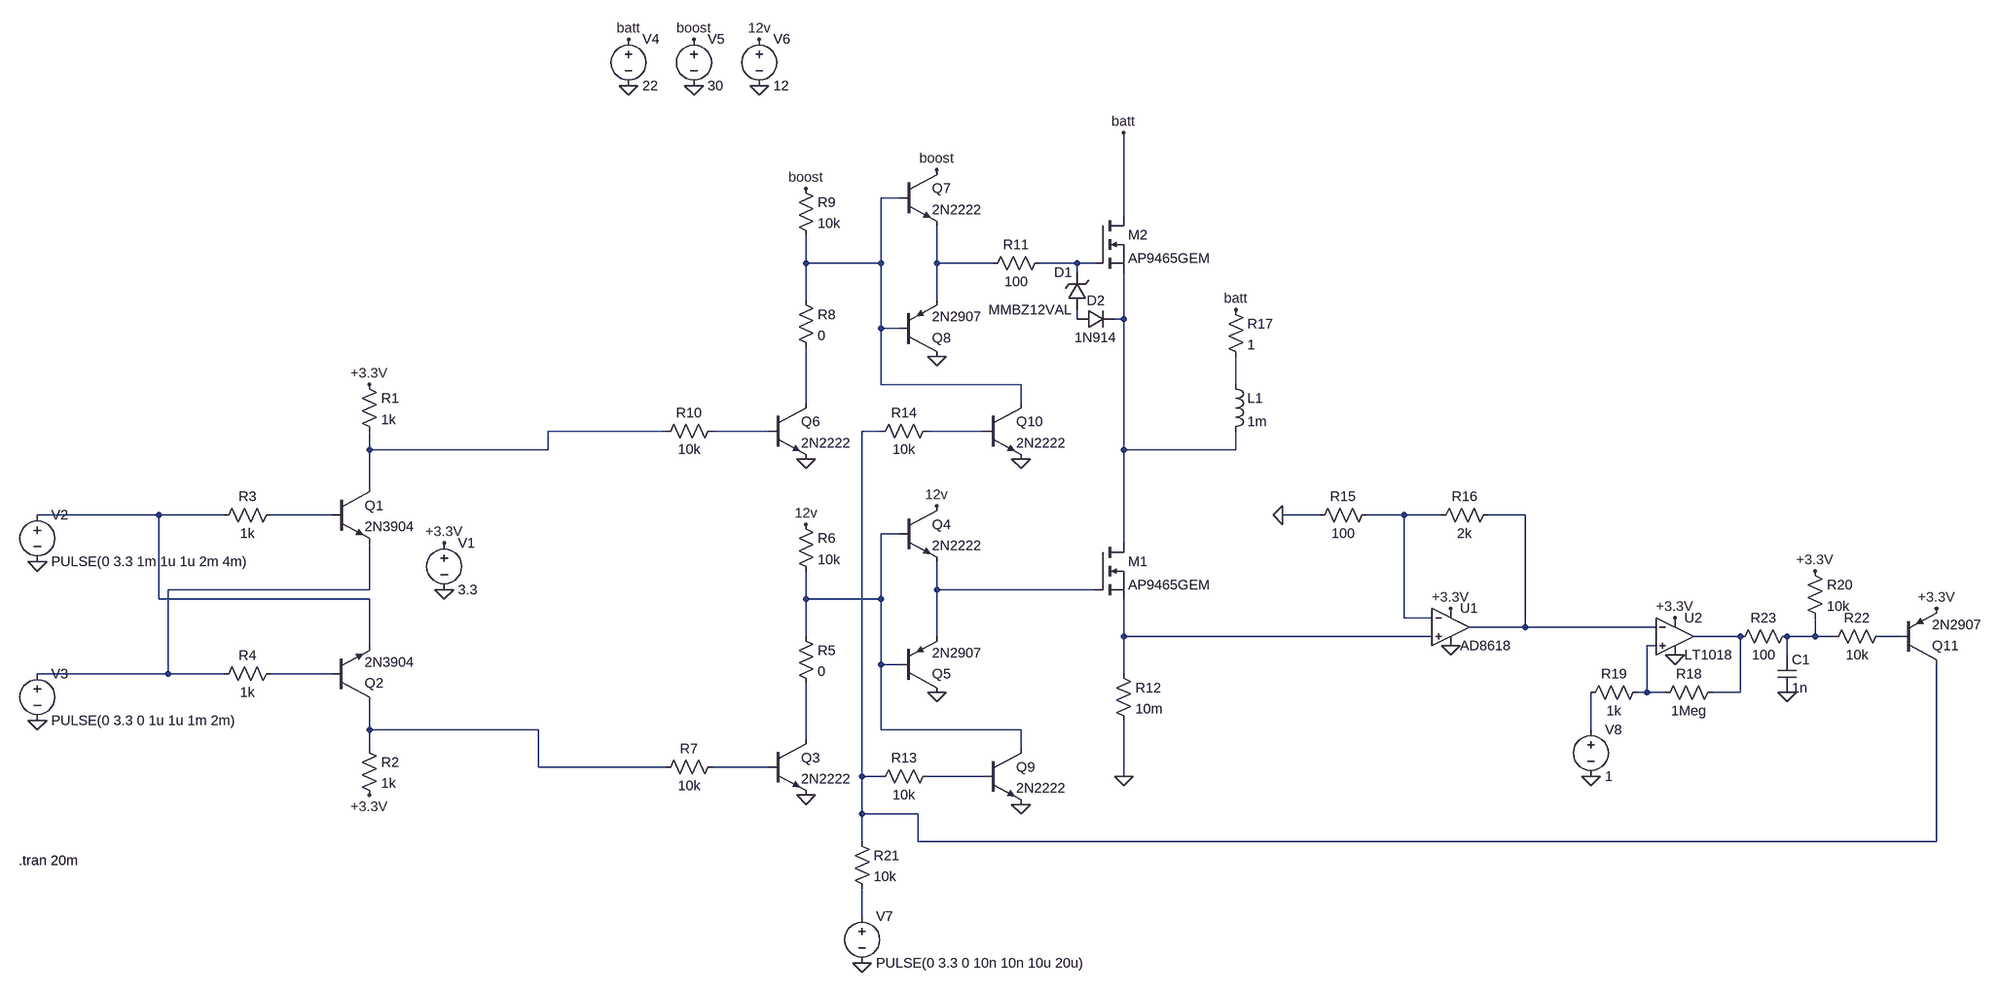
[diagram p0: schematic Half_Bridge_with_Shoot-thru_prot_and_PWM_ILIM.asc]
Half_Bridge_with_Shoot-thru_prot_and_PWM_ILIM.asc, the LTspice schematic file:
Version 4
SHEET 1 3380 868
WIRE 1296 -464 1264 -464
WIRE 1680 -432 1680 -576
WIRE 1136 -352 1136 -400
WIRE 1264 -352 1264 -464
WIRE 1264 -352 1136 -352
WIRE 1360 -352 1360 -416
WIRE 1456 -352 1360 -352
WIRE 1600 -352 1536 -352
WIRE 1632 -352 1600 -352
WIRE 1600 -336 1600 -352
WIRE 1136 -288 1136 -352
WIRE 1360 -288 1360 -352
WIRE 1600 -256 1600 -272
WIRE 1680 -256 1680 -336
WIRE 1680 -256 1664 -256
WIRE 1264 -240 1264 -352
WIRE 1296 -240 1264 -240
WIRE 1264 -144 1264 -240
WIRE 1504 -144 1264 -144
WIRE 1872 -144 1872 -192
WIRE 1136 -112 1136 -208
WIRE 1504 -112 1504 -144
WIRE 896 -64 624 -64
WIRE 1072 -64 976 -64
WIRE 1264 -64 1232 -64
WIRE 1440 -64 1344 -64
WIRE 160 -32 160 -64
WIRE 624 -32 624 -64
WIRE 624 -32 160 -32
WIRE 1680 -32 1680 -256
WIRE 1872 -32 1872 -64
WIRE 1872 -32 1680 -32
WIRE 160 32 160 -32
WIRE -224 80 -432 80
WIRE -112 80 -224 80
WIRE 96 80 -32 80
WIRE 2016 80 1952 80
WIRE 2160 80 2096 80
WIRE 2224 80 2160 80
WIRE 2368 80 2304 80
WIRE 1296 112 1264 112
WIRE 1680 128 1680 -32
WIRE 160 208 160 128
WIRE 160 208 -208 208
WIRE 1360 208 1360 160
WIRE 1632 208 1360 208
WIRE -224 224 -224 80
WIRE 160 224 -224 224
WIRE 1136 224 1136 176
WIRE 1264 224 1264 112
WIRE 1264 224 1136 224
WIRE 2160 256 2160 80
WIRE 2208 256 2160 256
WIRE 2368 272 2368 80
WIRE 2368 272 2272 272
WIRE 2592 272 2368 272
WIRE 1136 288 1136 224
WIRE 1360 288 1360 208
WIRE 1680 288 1680 224
WIRE 2208 288 1680 288
WIRE 2736 288 2656 288
WIRE 2864 288 2864 256
WIRE 2864 288 2816 288
WIRE 2896 288 2864 288
WIRE 3008 288 2976 288
WIRE 160 304 160 224
WIRE 2592 304 2576 304
WIRE 2816 320 2816 288
WIRE 1264 336 1264 224
WIRE 1296 336 1264 336
WIRE -208 352 -208 208
WIRE -208 352 -432 352
WIRE -112 352 -208 352
WIRE 96 352 -32 352
WIRE 1680 352 1680 288
WIRE 2576 384 2576 304
WIRE 2576 384 2560 384
WIRE 2608 384 2576 384
WIRE 2736 384 2736 288
WIRE 2736 384 2688 384
WIRE 160 448 160 400
WIRE 608 448 160 448
WIRE 1264 448 1264 336
WIRE 1504 448 1264 448
WIRE 2480 448 2480 384
WIRE 1136 464 1136 368
WIRE 160 480 160 448
WIRE 1504 480 1504 448
WIRE 608 512 608 448
WIRE 896 512 608 512
WIRE 1072 512 976 512
WIRE 1232 528 1232 -64
WIRE 1264 528 1232 528
WIRE 1440 528 1344 528
WIRE 1680 528 1680 432
WIRE 1232 592 1232 528
WIRE 1328 592 1232 592
WIRE 1232 640 1232 592
WIRE 1328 640 1328 592
WIRE 3072 640 3072 336
WIRE 3072 640 1328 640
WIRE 1232 768 1232 720
FLAG -432 160 0
FLAG -432 432 0
FLAG 288 208 0
FLAG 288 128 +3.3V
FLAG 160 -144 +3.3V
FLAG 160 560 +3.3V
FLAG 1056 -736 12v
FLAG 832 -736 batt
FLAG 944 -736 boost
FLAG 1680 -576 batt
FLAG 1360 384 0
FLAG 1680 528 0
FLAG 1136 560 0
FLAG 1136 96 12v
FLAG 1360 64 12v
FLAG 1360 -192 0
FLAG 1136 -16 0
FLAG 832 -656 0
FLAG 944 -656 0
FLAG 1056 -656 0
FLAG 1136 -480 boost
FLAG 1360 -512 boost
FLAG 1504 576 0
FLAG 1504 -16 0
FLAG 1232 848 0
FLAG 2240 304 0
FLAG 2240 240 +3.3V
FLAG 1952 80 0
FLAG 1872 -272 batt
FLAG 2624 256 +3.3V
FLAG 2624 320 0
FLAG 2480 528 0
FLAG 2864 176 +3.3V
FLAG 3072 240 +3.3V
FLAG 2816 384 0
SYMBOL npn 96 32 R0
SYMATTR InstName Q1
SYMATTR Value 2N3904
SYMBOL npn 96 400 M180
SYMATTR InstName Q2
SYMATTR Value 2N3904
SYMBOL res 144 -160 R0
SYMATTR InstName R1
SYMATTR Value 1k
SYMBOL res 144 464 R0
SYMATTR InstName R2
SYMATTR Value 1k
SYMBOL res -16 64 R90
WINDOW 0 0 56 VBottom 2
WINDOW 3 32 56 VTop 2
SYMATTR InstName R3
SYMATTR Value 1k
SYMBOL res -16 336 R90
WINDOW 0 0 56 VBottom 2
WINDOW 3 32 56 VTop 2
SYMATTR InstName R4
SYMATTR Value 1k
SYMBOL voltage 288 112 R0
SYMATTR InstName V1
SYMATTR Value 3.3
SYMBOL voltage -432 64 R0
WINDOW 123 0 0 Left 0
WINDOW 39 0 0 Left 0
SYMATTR InstName V2
SYMATTR Value PULSE(0 3.3 1m 1u 1u 2m 4m)
SYMBOL voltage -432 336 R0
WINDOW 123 0 0 Left 0
WINDOW 39 0 0 Left 0
SYMATTR InstName V3
SYMATTR Value PULSE(0 3.3 0 1u 1u 1m 2m)
SYMBOL nmos 1632 128 R0
SYMATTR InstName M1
SYMATTR Value AP9465GEM
SYMBOL nmos 1632 -432 R0
SYMATTR InstName M2
SYMATTR Value AP9465GEM
SYMBOL npn 1072 464 R0
SYMATTR InstName Q3
SYMATTR Value 2N2222
SYMBOL npn 1296 64 R0
SYMATTR InstName Q4
SYMATTR Value 2N2222
SYMBOL pnp 1296 384 M180
SYMATTR InstName Q5
SYMATTR Value 2N2907
SYMBOL voltage 832 -752 R0
SYMATTR InstName V4
SYMATTR Value 22
SYMBOL voltage 944 -752 R0
SYMATTR InstName V5
SYMATTR Value 30
SYMBOL voltage 1056 -752 R0
SYMATTR InstName V6
SYMATTR Value 12
SYMBOL res 1120 272 R0
SYMATTR InstName R5
SYMATTR Value 0
SYMBOL res 1120 80 R0
SYMATTR InstName R6
SYMATTR Value 10k
SYMBOL res 992 496 R90
WINDOW 0 0 56 VBottom 2
WINDOW 3 32 56 VTop 2
SYMATTR InstName R7
SYMATTR Value 10k
SYMBOL npn 1072 -112 R0
SYMATTR InstName Q6
SYMATTR Value 2N2222
SYMBOL npn 1296 -512 R0
SYMATTR InstName Q7
SYMATTR Value 2N2222
SYMBOL pnp 1296 -192 M180
SYMATTR InstName Q8
SYMATTR Value 2N2907
SYMBOL res 1120 -304 R0
SYMATTR InstName R8
SYMATTR Value 0
SYMBOL res 1120 -496 R0
SYMATTR InstName R9
SYMATTR Value 10k
SYMBOL res 992 -80 R90
WINDOW 0 0 56 VBottom 2
WINDOW 3 32 56 VTop 2
SYMATTR InstName R10
SYMATTR Value 10k
SYMBOL res 1552 -368 R90
WINDOW 0 0 56 VBottom 2
WINDOW 3 32 56 VTop 2
SYMATTR InstName R11
SYMATTR Value 100
SYMBOL zener 1616 -272 R180
WINDOW 0 24 64 Left 2
WINDOW 3 24 0 Left 2
SYMATTR InstName D1
SYMATTR Value MMBZ12VAL
SYMATTR Description Diode
SYMATTR Type diode
SYMBOL res 1664 336 R0
SYMATTR InstName R12
SYMATTR Value 10m
SYMBOL npn 1440 480 R0
SYMATTR InstName Q9
SYMATTR Value 2N2222
SYMBOL res 1360 512 R90
WINDOW 0 0 56 VBottom 2
WINDOW 3 32 56 VTop 2
SYMATTR InstName R13
SYMATTR Value 10k
SYMBOL npn 1440 -112 R0
SYMATTR InstName Q10
SYMATTR Value 2N2222
SYMBOL res 1360 -80 R90
WINDOW 0 0 56 VBottom 2
WINDOW 3 32 56 VTop 2
SYMATTR InstName R14
SYMATTR Value 10k
SYMBOL voltage 1232 752 R0
WINDOW 123 0 0 Left 0
WINDOW 39 0 0 Left 0
SYMATTR InstName V7
SYMATTR Value PULSE(0 3.3 0 10n 10n 10u 20u)
SYMBOL diode 1600 -240 R270
WINDOW 0 32 32 VTop 2
WINDOW 3 0 32 VBottom 2
SYMATTR InstName D2
SYMATTR Value 1N914
SYMBOL Opamps\\AD8618 2240 208 R0
SYMATTR InstName U1
SYMBOL res 2112 64 R90
WINDOW 0 0 56 VBottom 2
WINDOW 3 32 56 VTop 2
SYMATTR InstName R15
SYMATTR Value 100
SYMBOL res 2320 64 R90
WINDOW 0 0 56 VBottom 2
WINDOW 3 32 56 VTop 2
SYMATTR InstName R16
SYMATTR Value 2k
SYMBOL res 1856 -288 R0
SYMATTR InstName R17
SYMATTR Value 1
SYMBOL ind 1856 -160 R0
SYMATTR InstName L1
SYMATTR Value 1m
SYMBOL Comparators\\LT1018 2624 288 R0
SYMATTR InstName U2
SYMBOL voltage 2480 432 R0
SYMATTR InstName V8
SYMATTR Value 1
SYMBOL res 2848 160 R0
SYMATTR InstName R20
SYMATTR Value 10k
SYMBOL res 1216 624 R0
SYMATTR InstName R21
SYMATTR Value 10k
SYMBOL pnp 3008 336 M180
SYMATTR InstName Q11
SYMATTR Value 2N2907
SYMBOL res 2992 272 R90
WINDOW 0 0 56 VBottom 2
WINDOW 3 32 56 VTop 2
SYMATTR InstName R22
SYMATTR Value 10k
SYMBOL res 2704 368 R90
WINDOW 0 0 56 VBottom 2
WINDOW 3 32 56 VTop 2
SYMATTR InstName R18
SYMATTR Value 1Meg
SYMBOL res 2576 368 R90
WINDOW 0 0 56 VBottom 2
WINDOW 3 32 56 VTop 2
SYMATTR InstName R19
SYMATTR Value 1k
SYMBOL cap 2800 320 R0
SYMATTR InstName C1
SYMATTR Value 1n
SYMBOL res 2832 272 R90
WINDOW 0 0 56 VBottom 2
WINDOW 3 32 56 VTop 2
SYMATTR InstName R23
SYMATTR Value 100
TEXT -464 672 Left 2 !.tran 20m

The netlist it stands for:
* Half_Bridge_with_Shoot-thru_prot_and_PWM_ILIM.asc
Q1 N008 N013 N017 0 2N3904
Q2 N025 N024 N012 0 2N3904
R1 +3.3V N008 1k
R2 N025 +3.3V 1k
R3 N013 N012 1k
R4 N024 N017 1k
V1 +3.3V 0 3.3
V2 N012 0 PULSE(0 3.3 1m 1u 1u 2m 4m)
V3 N017 0 PULSE(0 3.3 0 1u 1u 1m 2m)
M1 N005 N018 N019 N019 AP9465GEM
M2 batt N003 N005 N005 AP9465GEM
Q3 N027 N028 0 0 2N2222
Q4 12v N016 N018 0 2N2222
Q5 0 N016 N018 0 2N2907
V4 batt 0 22
V5 boost 0 30
V6 12v 0 12
R5 N016 N027 0
R6 12v N016 10k
R7 N028 N025 10k
Q6 N007 N009 0 0 2N2222
Q7 boost N001 N002 0 2N2222
Q8 0 N001 N002 0 2N2907
R8 N001 N007 0
R9 boost N001 10k
R10 N009 N008 10k
R11 N003 N002 100
D1 N004 N003 MMBZ12VAL
R12 N019 0 10m
Q9 N016 N029 0 0 2N2222
R13 N029 N010 10k
Q10 N001 N011 0 0 2N2222
R14 N011 N010 10k
V7 N030 0 PULSE(0 3.3 0 10n 10n 10u 20u)
D2 N004 N005 1N914
XU1 N019 N014 +3.3V 0 N015 AD8618  ; pins In+ In- V+ V- OUT
R15 N014 0 100
R16 N015 N014 2k
R17 batt N006 1
L1 N006 N005 1m
XU2 N023 N015 +3.3V 0 N020 LT1018  ; pins In+ In- V+ V- OUT
V8 N026 0 1
R20 +3.3V N021 10k
R21 N010 N030 10k
Q11 N010 N022 +3.3V 0 2N2907
R22 N022 N021 10k
R18 N020 N023 1Meg
R19 N023 N026 1k
C1 N021 0 1n
R23 N021 N020 100
.model D D
.lib standard.dio
.model NPN NPN
.model PNP PNP
.lib standard.bjt
.model NMOS NMOS
.model PMOS PMOS
.lib standard.mos
.tran 20m
.lib LTC1.lib
.backanno
.end